# Altium schematic sheet S7CAS-PLEIADES-CARTE-MERE_Pxx_FPGA_bank2_4.SchDoc
size Tabloid; SheetNumber: 6; SheetTotal: 18; Sheet_Name: BANK 2 & 4; Size: 11x17
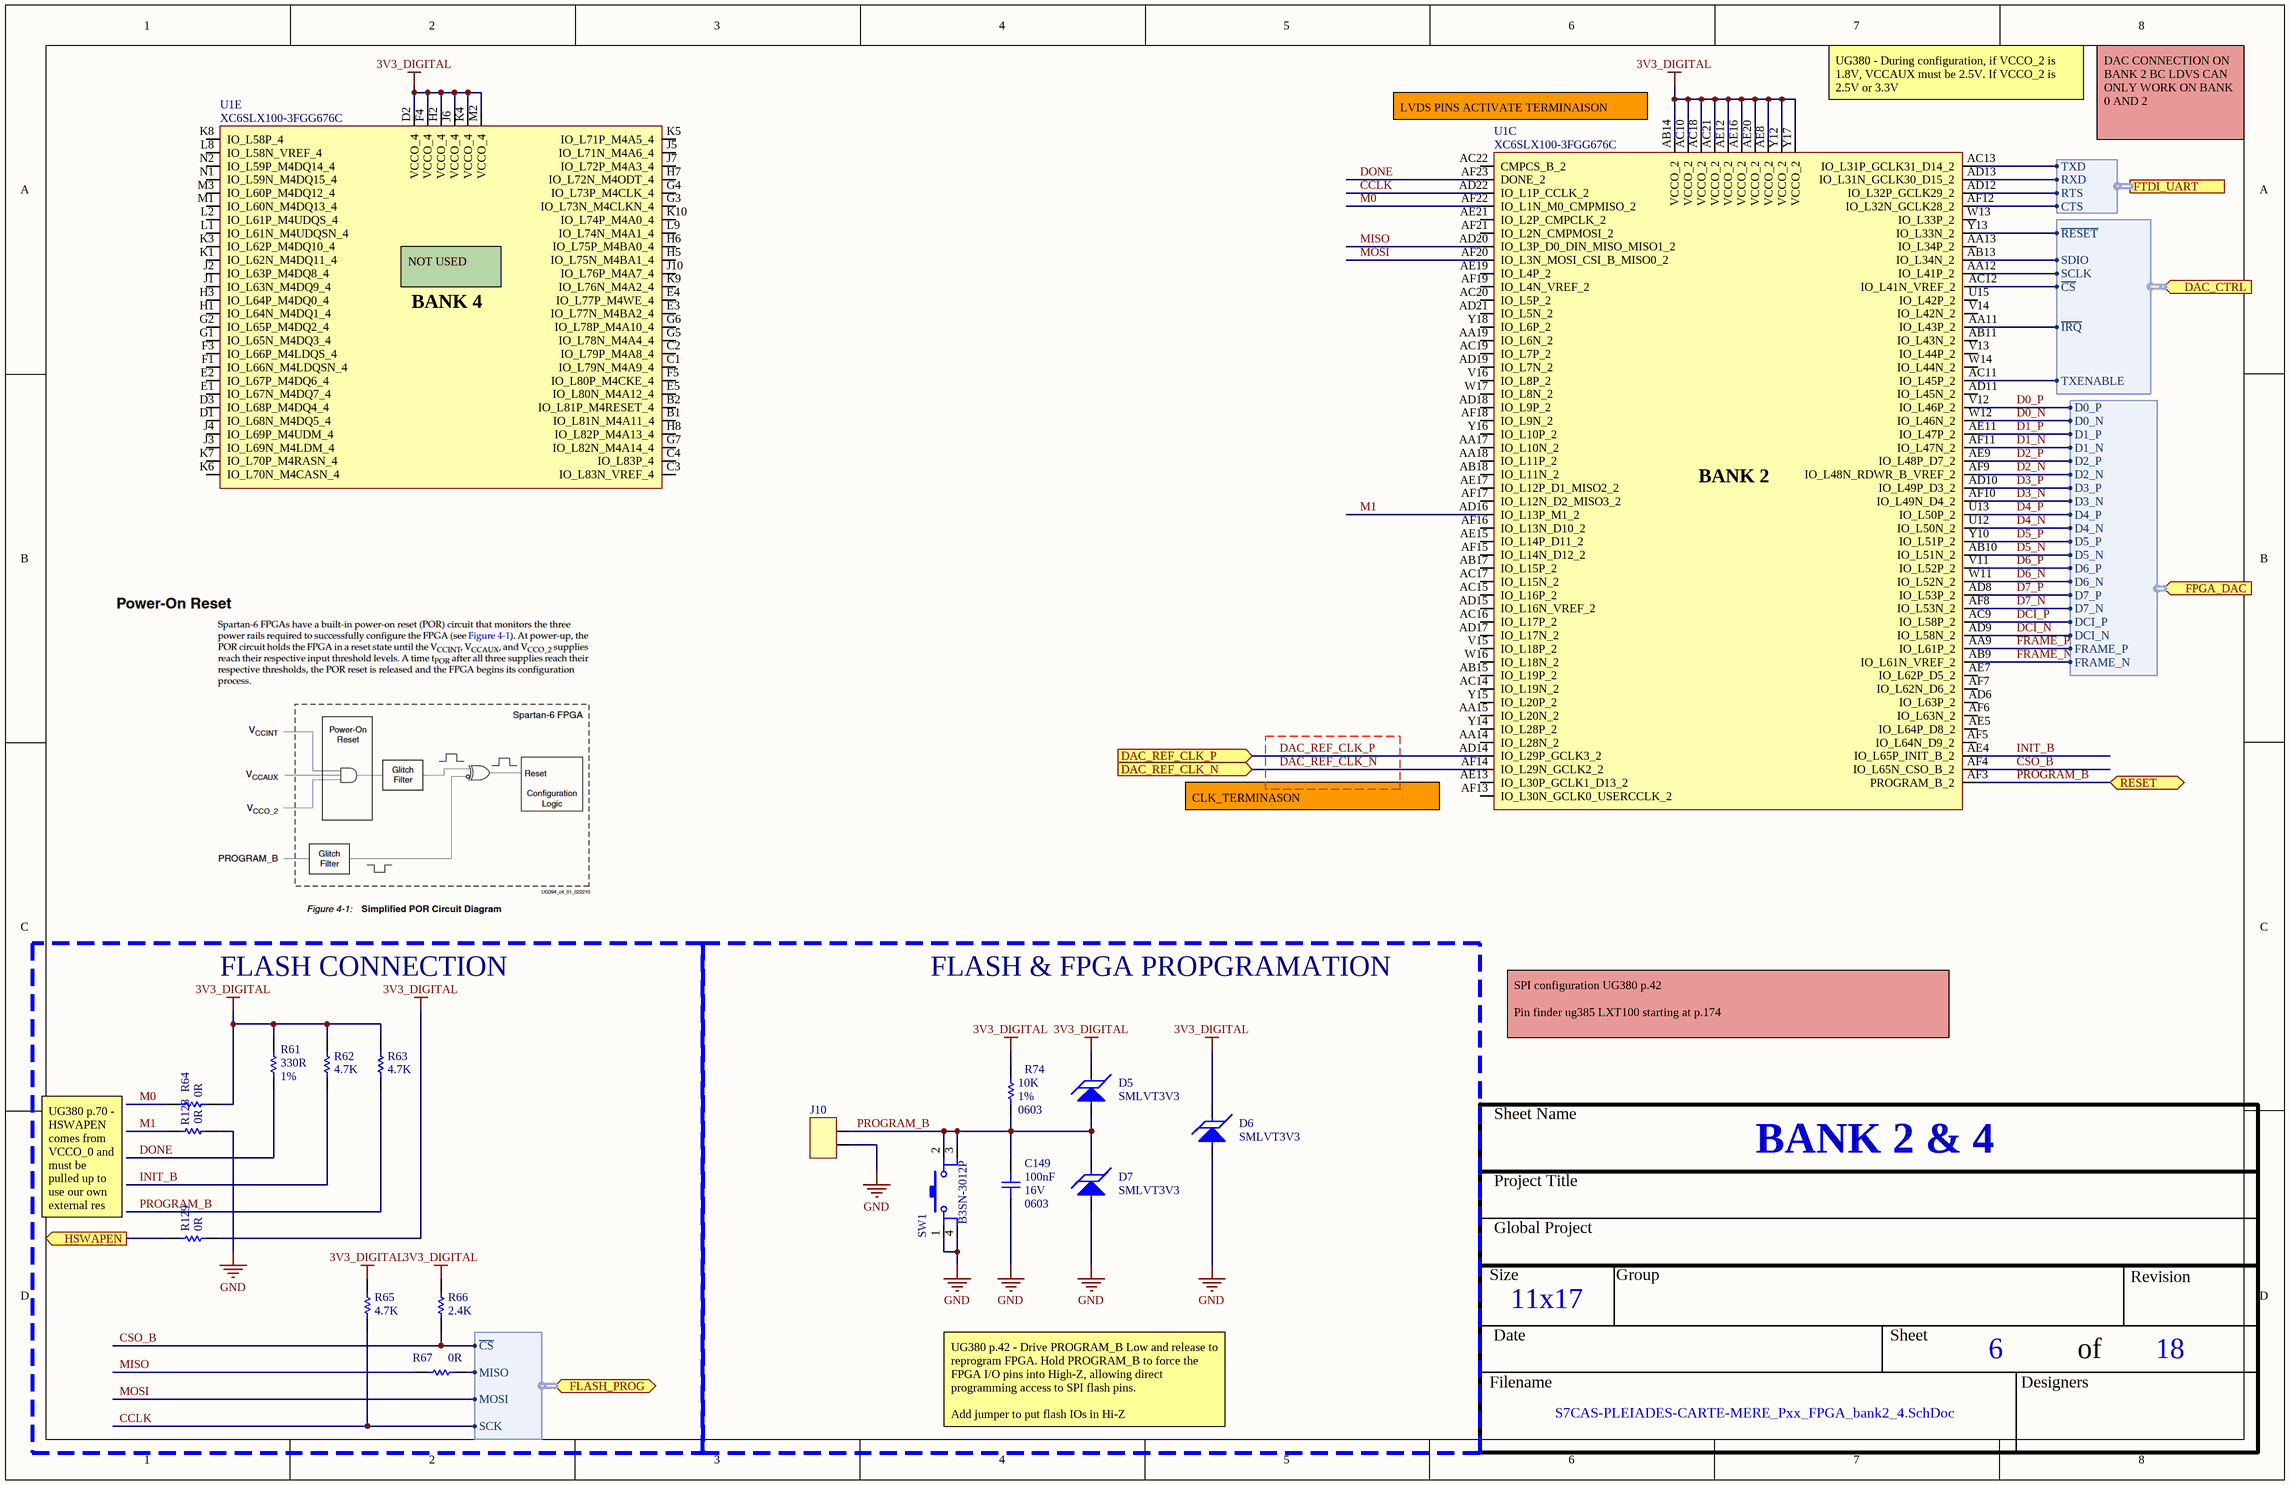
[diagram p0: S7CAS-PLEIADES-CARTE-MERE_Pxx_FPGA_bank2_4.SchDoc]

## Parts
C149  value 100nF  Voltage: 16V  Package: 0603  [CAP_0603]  (hidden comment: CAP - 0603)
D5  SMLVT3V3  [TVS_POW_SMLVT3V3]
D6  SMLVT3V3  [TVS_POW_SMLVT3V3]
D7  SMLVT3V3  [TVS_POW_SMLVT3V3]
J10  Part Number  [MALE HEADER - 1x2 2.54mm]  (value not drawn)
R61  value 330R  Precision: 1%  [RES_0603]  (hidden comment: RES - 0603)
R62  value 4.7K  [RES_0603]  (hidden comment: RES - 0603)
R63  value 4.7K  [RES_0603]  (hidden comment: RES - 0603)
R64  value 0R  [RES_0603]  (hidden comment: RES - 0603)
R65  value 4.7K  [RES_0603]  (hidden comment: RES - 0603)
R66  value 2.4K  [RES_0603]  (hidden comment: RES - 0603)
R67  value 0R  [RES_0603]  (hidden comment: RES - 0603)
R74  value 10K  Package: 0603  Precision: 1%  [RES_0603]  (hidden comment: RES - 0603)
R128  value 0R  [RES_0603]  (hidden comment: RES - 0603)
R129  value 0R  [RES_0603]  (hidden comment: RES - 0603)
SW1  B3SN-3012P  [SWI_TACT_B3SN-3012P]
U1  XC6SLX100-3FGG676C  [FPGA_XILINX_FGG676]  (parts C,E of 10)

## Blocks framed on the sheet
FLASH CONNECTION: R61-R67 R128 R129
FLASH & FPGA PROPGRAMATION: C149 D5-D7 J10 R74 SW1

## Ports
DAC_CTRL (in, harness DAC_CTRL_HARNESS, see S7CAS-PLEIADES-CARTE-MERE_Pxx_CNA[2C]), DAC_REF_CLK_N (in, see S7CAS-PLEIADES-CARTE-MERE_Pxx_CNA[2C]), DAC_REF_CLK_P (in, see S7CAS-PLEIADES-CARTE-MERE_Pxx_CNA[2C]), FLASH_PROG (bidir, harness FLASH_PROG, see S7CAS-PLEIADES-CARTE-MERE_Pxx_FLASH_PHY_CLOCK[2D]), FPGA_DAC (in, harness DAC_HARNESS, see S7CAS-PLEIADES-CARTE-MERE_Pxx_CNA[2A]), FTDI_UART (harness FTDI_HARNESS, see S7CAS-PLEIADES-CARTE-MERE_Pxx_DEBUG_USB[2D]), HSWAPEN (out, see S7CAS-PLEIADES-CARTE-MERE_Pxx_FPGA_bank0_1_5[1A]), RESET (bidir, see S7CAS-PLEIADES-CARTE-MERE_Pxx_DEBUG_USB[2D])

## Harnesses
FLASH_PROG: MISO, MOSI, SCK, ~{CS}
FTDI_HARNESS: TXD, RXD, RTS, CTS
DAC_HARNESS: D0_P, D1_P, D2_P, D3_P, D4_P, D5_P, D6_P, D7_P, DCI_P, DCI_N, FRAME_P, FRAME_N, D2_N, D4_N, D6_N, D7_N, D5_N, D1_N, D3_N, D0_N
DAC_CTRL_HARNESS: ~{RESET}, SDIO, ~{CS}, SCLK, ~{IRQ}, TXENABLE

## Nets
3V3_DIGITAL: D5.K D6.K R61.2 R62.2 R63.2 R64.2 R65.2 R66.2 R74.2 R129.2 U1.AB14(VCCO_2) U1.AC10(VCCO_2) U1.AC18(VCCO_2) U1.AC21(VCCO_2) U1.AE8(VCCO_2) U1.AE12(VCCO_2) U1.AE16(VCCO_2) U1.AE20(VCCO_2) U1.D2(VCCO_4) U1.F4(VCCO_4) U1.H2(VCCO_4) U1.J6(VCCO_4) U1.K4(VCCO_4) U1.M2(VCCO_4) U1.Y12(VCCO_2) U1.Y17(VCCO_2)
GND: C149.1 D6.A D7.A J10.2 R128.2 SW1.1 SW1.4
CCLK: R65.1 U1.AD22(IO_L1P_CCLK_2) ; port FLASH_PROG.SCK
CSO_B: R66.1 U1.AF4(IO_L65N_CSO_B_2) ; port FLASH_PROG.~{CS}
D0_N: U1.W12(IO_L46N_2) ; port FPGA_DAC.D0_N
D0_P: U1.V12(IO_L46P_2) ; port FPGA_DAC.D0_P
D1_N: U1.AF11(IO_L47N_2) ; port FPGA_DAC.D1_N
D1_P: U1.AE11(IO_L47P_2) ; port FPGA_DAC.D1_P
D2_N: U1.AF9(IO_L48N_RDWR_B_VREF_2) ; port FPGA_DAC.D2_N
D2_P: U1.AE9(IO_L48P_D7_2) ; port FPGA_DAC.D2_P
D3_N: U1.AF10(IO_L49N_D4_2) ; port FPGA_DAC.D3_N
D3_P: U1.AD10(IO_L49P_D3_2) ; port FPGA_DAC.D3_P
D4_N: U1.U12(IO_L50N_2) ; port FPGA_DAC.D4_N
D4_P: U1.U13(IO_L50P_2) ; port FPGA_DAC.D4_P
D5_N: U1.AB10(IO_L51N_2) ; port FPGA_DAC.D5_N
D5_P: U1.Y10(IO_L51P_2) ; port FPGA_DAC.D5_P
D6_N: U1.W11(IO_L52N_2) ; port FPGA_DAC.D6_N
D6_P: U1.V11(IO_L52P_2) ; port FPGA_DAC.D6_P
D7_N: U1.AF8(IO_L53N_2) ; port FPGA_DAC.D7_N
D7_P: U1.AD8(IO_L53P_2) ; port FPGA_DAC.D7_P
DAC_REF_CLK_N: U1.AF14(IO_L29N_GCLK2_2) ; port DAC_REF_CLK_N
DAC_REF_CLK_P: U1.AD14(IO_L29P_GCLK3_2) ; port DAC_REF_CLK_P
DCI_N: U1.AD9(IO_L58N_2) ; port FPGA_DAC.DCI_N
DCI_P: U1.AC9(IO_L58P_2) ; port FPGA_DAC.DCI_P
DONE: R61.1 U1.AF23(DONE_2)
FRAME_N: U1.AB9(IO_L61N_VREF_2) ; port FPGA_DAC.FRAME_N
FRAME_P: U1.AA9(IO_L61P_2) ; port FPGA_DAC.FRAME_P
HSWAPEN: R129.1 ; port HSWAPEN
INIT_B: R62.1 U1.AE4(IO_L65P_INIT_B_2)
M0: R64.1 U1.AF22(IO_L1N_M0_CMPMISO_2)
M1: R128.1 U1.AD16(IO_L13P_M1_2)
MISO: R67.2 U1.AD20(IO_L3P_D0_DIN_MISO_MISO1_2)
MOSI: U1.AF20(IO_L3N_MOSI_CSI_B_MISO0_2) ; port FLASH_PROG.MOSI
PROGRAM_B: C149.2 D5.A D7.K J10.1 R63.1 R74.1 SW1.2 SW1.3 U1.AF3(PROGRAM_B_2) ; port RESET
NetR67_1: R67.1 ; port FLASH_PROG.MISO
NetU1_AA11: U1.AA11(IO_L43P_2) ; port DAC_CTRL.~{IRQ}
NetU1_AA12: U1.AA12(IO_L41P_2) ; port DAC_CTRL.SCLK
NetU1_AB13: U1.AB13(IO_L34N_2) ; port DAC_CTRL.SDIO
NetU1_AC11: U1.AC11(IO_L45P_2) ; port DAC_CTRL.TXENABLE
NetU1_AC12: U1.AC12(IO_L41N_VREF_2) ; port DAC_CTRL.~{CS}
NetU1_AC13: U1.AC13(IO_L31P_GCLK31_D14_2) ; port FTDI_UART.TXD
NetU1_AD12: U1.AD12(IO_L32P_GCLK29_2) ; port FTDI_UART.RTS
NetU1_AD13: U1.AD13(IO_L31N_GCLK30_D15_2) ; port FTDI_UART.RXD
NetU1_AF12: U1.AF12(IO_L32N_GCLK28_2) ; port FTDI_UART.CTS
NetU1_Y13: U1.Y13(IO_L33N_2) ; port DAC_CTRL.~{RESET}

Not connected (* = marked no-connect by the designer): U1 AA13(IO_L34P_2) AA14(IO_L28N_2) AA15(IO_L20N_2) AA17(IO_L10N_2) AA18(IO_L11P_2) AA19(IO_L6N_2) AB11(IO_L43N_2) AB15(IO_L19P_2) AB17(IO_L15P_2) AB18(IO_L11N_2) AC14(IO_L19N_2) AC15(IO_L16P_2) AC16(IO_L17P_2) AC17(IO_L15N_2) AC19(IO_L7P_2) AC20(IO_L5P_2) AC22(CMPCS_B_2) AD6(IO_L63P_2) AD11(IO_L45N_2) AD15(IO_L16N_VREF_2) AD17(IO_L17N_2) AD18(IO_L9P_2) AD19(IO_L7N_2) AD21(IO_L5N_2) AE5(IO_L64P_D8_2) AE7(IO_L62P_D5_2) AE13(IO_L30P_GCLK1_D13_2) AE15(IO_L14P_D11_2) AE17(IO_L12P_D1_MISO2_2) AE19(IO_L4P_2) AE21(IO_L2P_CMPCLK_2) AF5(IO_L64N_D9_2) AF6(IO_L63N_2) AF7(IO_L62N_D6_2) AF13(IO_L30N_GCLK0_USERCCLK_2) AF15(IO_L14N_D12_2) AF16(IO_L13N_D10_2) AF17(IO_L12N_D2_MISO3_2) AF18(IO_L9N_2) AF19(IO_L4N_VREF_2) AF21(IO_L2N_CMPMOSI_2) B1(IO_L81N_M4A11_4) B2(IO_L81P_M4RESET_4) C1(IO_L79N_M4A9_4) C2(IO_L79P_M4A8_4) C3(IO_L83N_VREF_4) C4(IO_L83P_4) D1(IO_L68N_M4DQ5_4) D3(IO_L68P_M4DQ4_4) E1(IO_L67N_M4DQ7_4) E2(IO_L67P_M4DQ6_4) E3(IO_L77N_M4BA2_4) E4(IO_L77P_M4WE_4) E5(IO_L80N_M4A12_4) F1(IO_L66N_M4LDQSN_4) F3(IO_L66P_M4LDQS_4) F5(IO_L80P_M4CKE_4) G1(IO_L65N_M4DQ3_4) G2(IO_L65P_M4DQ2_4) G3(IO_L73N_M4CLKN_4) G4(IO_L73P_M4CLK_4) G5(IO_L78N_M4A4_4) G6(IO_L78P_M4A10_4) G7(IO_L82N_M4A14_4) H1(IO_L64N_M4DQ1_4) H3(IO_L64P_M4DQ0_4) H5(IO_L75N_M4BA1_4) H6(IO_L75P_M4BA0_4) H7(IO_L72N_M4ODT_4) H8(IO_L82P_M4A13_4) J1(IO_L63N_M4DQ9_4) J2(IO_L63P_M4DQ8_4) J3(IO_L69N_M4LDM_4) J4(IO_L69P_M4UDM_4) J5(IO_L71N_M4A6_4) J7(IO_L72P_M4A3_4) J10(IO_L76P_M4A7_4) K1(IO_L62N_M4DQ11_4) K3(IO_L62P_M4DQ10_4) K5(IO_L71P_M4A5_4) K6(IO_L70N_M4CASN_4) K7(IO_L70P_M4RASN_4) K8(IO_L58P_4) K9(IO_L76N_M4A2_4) K10(IO_L74P_M4A0_4) L1(IO_L61N_M4UDQSN_4) L2(IO_L61P_M4UDQS_4) L8(IO_L58N_VREF_4) L9(IO_L74N_M4A1_4) M1(IO_L60N_M4DQ13_4) M3(IO_L60P_M4DQ12_4) N1(IO_L59N_M4DQ15_4) N2(IO_L59P_M4DQ14_4) U15(IO_L42P_2) V13(IO_L44P_2) V14(IO_L42N_2) V15(IO_L18P_2) V16(IO_L8P_2) W13(IO_L33P_2) W14(IO_L44N_2) W16(IO_L18N_2) W17(IO_L8N_2) Y14(IO_L28P_2) Y15(IO_L20P_2) Y16(IO_L10P_2) Y18(IO_L6P_2)

## Notes on the sheet
- UG380 - During configuration, if VCCO_2 is 1.8V, VCCAUX must be 2.5V. If VCCO_2 is 2.5V or 3.3V
- (near U1) LVDS PINS ACTIVATE TERMINAISON
- DAC CONNECTION ON BANK 2 BC LDVS CAN ONLY WORK ON BANK 0 AND 2
- (near U1) NOT USED
- CLK_TERMINASON
- SPI configuration UG380 p.42
  Pin finder ug385 LXT100 starting at p.174
- UG380 p.70 - HSWAPEN comes from VCCO_0 and must be pulled up to use our own external res
- UG380 p.42 - Drive PROGRAM_B Low and release to reprogram FPGA. Hold PROGRAM_B to force the FPGA I/O pins into High-Z, allowing direct programming access to SPI flash pins.
  Add jumper to put flash IOs in Hi-Z
- Sheet Name
- Project Title
- Global Project
- Size
- Group
- Revision
- Date
- Sheet
- of
- Filename
- Designers
- (in symbol FPGA_XC6SLX100-3FGG676C, part C) BANK 2
- (in symbol FPGA_XC6SLX100-3FGG676C, part E) BANK 4

## Library data of the parts
C149 = CAP - 0603: Precision: 10%; Current: *; CreatedBy: Jonathan Bouchard; Power: *; Supplier 1: Arrow Electronics; Supplier Part Number 1: CL10B104KO8NNNC
D5-D7 = TVS_POW_SMLVT3V3: TVS - 3.3V 10.3V 600W - DO214AA; Manufacturer #1: STMicroelectronics; Value: Vbr = 4.1V -  Clamp = 10.3V; Voltage Rating: 3.3V Standoff; Current Rating: 200A (Ifsm); Power Max: 600W (Ppp); GRAMS Lib Spec: 2.8; Magnetic Material: UNKNOWN; Polarized: YES; Tolerance: *; HelpURL: https://www.st.com/content/ccc/resource/technical/document/datasheet/da/a4/86/90/17/13/47/7c/CD00000923.pdf/files/CD00000923.pdf/jcr:content/translations/en.CD00000923.pdf; CreatedBy/Date: Jonathan Bouchard - 2019-04-27; VerifiedBy: Nicolas V. (2019-05-06); Temperature: -55°C ~ 175°C (TJ); Package: DO214AA; Manufacturer #2: *; Note: *; Assembly Type: SMD; Part Number #2: *; Part Number #1: SMLVT3V3; Supplier 1: Digi-Key; Supplier Part Number 1: 497-2496-1-ND; Cryo: UNKNOWN
J10 = MALE HEADER - 1x2 2.54mm: MALE HEADER - 2.54mm 1x2; GRAMS Lib Spec: 2.7
R62-R67 R128 R129 = RES - 0603: Precision: 1%; Current: *; CreatedBy: Jonathan Bouchard; Package: 0603
  R62 R63 R65: Supplier 1: Arrow Electronics; Supplier Part Number 1: RMCF0603FT4K70
  R64 R67 R128 R129: Supplier 1: Arrow Electronics; Supplier Part Number 1: RMCF0603ZT0R00
  R66: Supplier 1: Mouser; Supplier Part Number 1: 603-RC0603FR-132K4L
SW1 = SWI_TACT_B3SN-3012P: SWI - TACT SPST-NO 0.05A 24V - 4-SMD; Current: 50mA; Mfg: Omron; Mfg Part Number: B3SN-3012P; HelpURL: http://www.omron.com/ecb/products/pdf/en-b3sn.pdf; CreatedBy: Jonathan Bouchard; Temperature: -25°C ~ 70°C; Power: *; Precision: *; Package: 4-SMD; Value: *; Voltage: 24V; Supplier 1: Digikey; Supplier Part Number 1: SW261CT-ND
U1 = FPGA_XC6SLX100-3FGG676C: FPGA - XILINX SPARTAN 6 480 I/O - BGA-676; Voltage: 1.14 V ~ 1.26 V; Current: *; Power: *; Mfg: Xilinx; Mfg Part Number: XC6SLX100-3FGG676C; HelpURL: https://www.xilinx.com/support/documentation/data_sheets/ds162.pdf; CreatedBy: Jonathan Bouchard; Temperature: 0°C ~ 85°C (TJ); Value: *; Precision: *; Package: BGA-676; Supplier 1: Digikey; Supplier Part Number 1: 122-1760-ND
R61 R74 = RES - 0603: Current: *; CreatedBy: Jonathan Bouchard
  R61: Package: 0603
  R74: Supplier 1: Arrow Electronics; Supplier Part Number 1: RMCF0603FT10K0